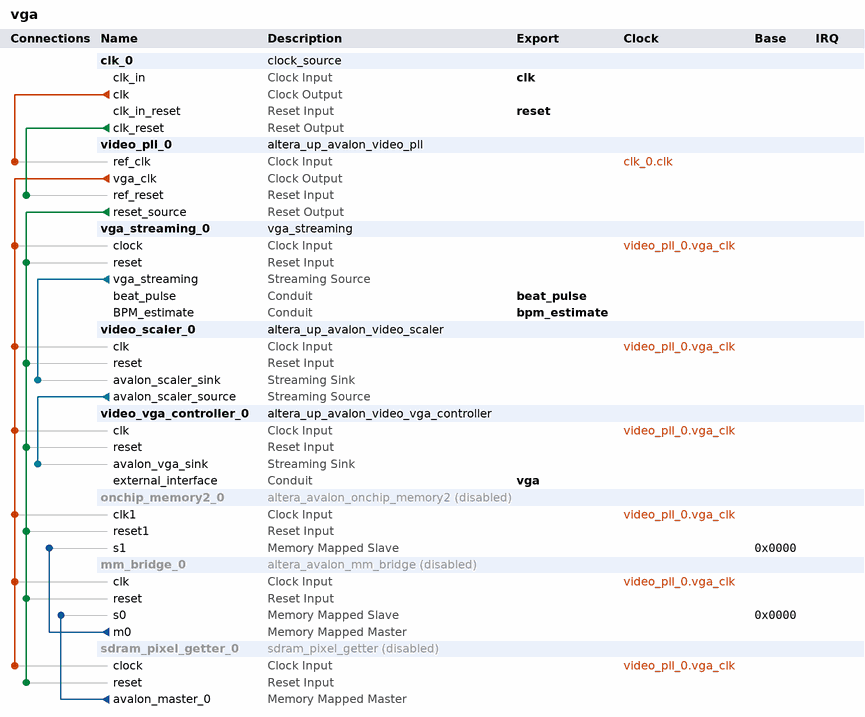
[diagram p0: system contents]
# Platform Designer (Qsys) system vga, Cyclone IV E EP4CE115F29C7
# Parameters at their usual value, and those the tool derives, are not listed.
package require -exact qsys 20.1
create_system vga
set_project_property DEVICE_FAMILY {Cyclone IV E}
set_project_property DEVICE EP4CE115F29C7

add_instance clk_0 clock_source 20.1
set_instance_parameter_value clk_0 clockFrequency 50000000

add_instance video_pll_0 altera_up_avalon_video_pll 18.0
set_instance_parameter_value video_pll_0 camera {5MP Digital Camera (THDB_D5M)}
set_instance_parameter_value video_pll_0 gui_refclk 50.0
set_instance_parameter_value video_pll_0 lcd {7" LCD on VEEK-MT and MTL/MTL2 Modules}

add_instance vga_streaming_0 vga_streaming 1.0
set_instance_parameter_value vga_streaming_0 HEIGHT 240
set_instance_parameter_value vga_streaming_0 PIXEL_BITS 8
set_instance_parameter_value vga_streaming_0 WIDTH 320

add_instance video_scaler_0 altera_up_avalon_video_scaler 18.0
set_instance_parameter_value video_scaler_0 color_bits 10
set_instance_parameter_value video_scaler_0 color_planes 3
set_instance_parameter_value video_scaler_0 height_scaling 2
set_instance_parameter_value video_scaler_0 width_in 320
set_instance_parameter_value video_scaler_0 width_scaling 2

add_instance video_vga_controller_0 altera_up_avalon_video_vga_controller 18.0
set_instance_parameter_value video_vga_controller_0 board DE2-115
set_instance_parameter_value video_vga_controller_0 resolution {VGA 640x480}

add_instance onchip_memory2_0 altera_avalon_onchip_memory2 20.1
set_instance_property onchip_memory2_0 ENABLED false
set_instance_parameter_value onchip_memory2_0 blockType M9K
set_instance_parameter_value onchip_memory2_0 dataWidth 16
set_instance_parameter_value onchip_memory2_0 dualPort false
set_instance_parameter_value onchip_memory2_0 initMemContent true
set_instance_parameter_value onchip_memory2_0 initializationFileName tv.hex
set_instance_parameter_value onchip_memory2_0 memorySize 38400
set_instance_parameter_value onchip_memory2_0 useNonDefaultInitFile true

add_instance mm_bridge_0 altera_avalon_mm_bridge 20.1
set_instance_property mm_bridge_0 ENABLED false
set_instance_parameter_value mm_bridge_0 ADDRESS_UNITS WORDS
set_instance_parameter_value mm_bridge_0 ADDRESS_WIDTH 16
set_instance_parameter_value mm_bridge_0 DATA_WIDTH 16
set_instance_parameter_value mm_bridge_0 MAX_PENDING_RESPONSES 4
set_instance_parameter_value mm_bridge_0 USE_AUTO_ADDRESS_WIDTH 0

add_instance sdram_pixel_getter_0 sdram_pixel_getter 1.0
set_instance_property sdram_pixel_getter_0 ENABLED false
set_instance_parameter_value sdram_pixel_getter_0 ADDR_WIDTH 32
set_instance_parameter_value sdram_pixel_getter_0 HEIGHT 480
set_instance_parameter_value sdram_pixel_getter_0 PIXEL_BITS 16
set_instance_parameter_value sdram_pixel_getter_0 WIDTH 640

# connections
add_connection clk_0.clk video_pll_0.ref_clk clock
add_connection video_pll_0.vga_clk mm_bridge_0.clk clock
add_connection video_pll_0.vga_clk onchip_memory2_0.clk1 clock
add_connection video_pll_0.vga_clk sdram_pixel_getter_0.clock clock
add_connection video_pll_0.vga_clk vga_streaming_0.clock clock
add_connection video_pll_0.vga_clk video_scaler_0.clk clock
add_connection video_pll_0.vga_clk video_vga_controller_0.clk clock
add_connection clk_0.clk_reset video_pll_0.ref_reset reset
add_connection video_pll_0.reset_source mm_bridge_0.reset reset
add_connection video_pll_0.reset_source onchip_memory2_0.reset1 reset
add_connection video_pll_0.reset_source sdram_pixel_getter_0.reset reset
add_connection video_pll_0.reset_source vga_streaming_0.reset reset
add_connection video_pll_0.reset_source video_scaler_0.reset reset
add_connection video_pll_0.reset_source video_vga_controller_0.reset reset
add_connection mm_bridge_0.m0 onchip_memory2_0.s1 avalon
set_connection_parameter_value mm_bridge_0.m0/onchip_memory2_0.s1 baseAddress 0x0000
add_connection sdram_pixel_getter_0.avalon_master_0 mm_bridge_0.s0 avalon
set_connection_parameter_value sdram_pixel_getter_0.avalon_master_0/mm_bridge_0.s0 baseAddress 0x0000
add_connection vga_streaming_0.vga_streaming video_scaler_0.avalon_scaler_sink avalon_streaming
add_connection video_scaler_0.avalon_scaler_source video_vga_controller_0.avalon_vga_sink avalon_streaming

# exported interfaces
add_interface beat_pulse conduit end
set_interface_property beat_pulse EXPORT_OF vga_streaming_0.beat_pulse
add_interface bpm_estimate conduit end
set_interface_property bpm_estimate EXPORT_OF vga_streaming_0.BPM_estimate
add_interface clk clock sink
set_interface_property clk EXPORT_OF clk_0.clk_in
add_interface reset reset sink
set_interface_property reset EXPORT_OF clk_0.clk_in_reset
add_interface vga conduit end
set_interface_property vga EXPORT_OF video_vga_controller_0.external_interface

set_interconnect_requirement {$system} qsys_mm.clockCrossingAdapter HANDSHAKE
set_interconnect_requirement {$system} qsys_mm.enableEccProtection FALSE
set_interconnect_requirement {$system} qsys_mm.insertDefaultSlave FALSE
set_interconnect_requirement {$system} qsys_mm.maxAdditionalLatency 1

save_system vga.qsys
